# Altium schematic sheet Sheet2.SchDoc
size A3
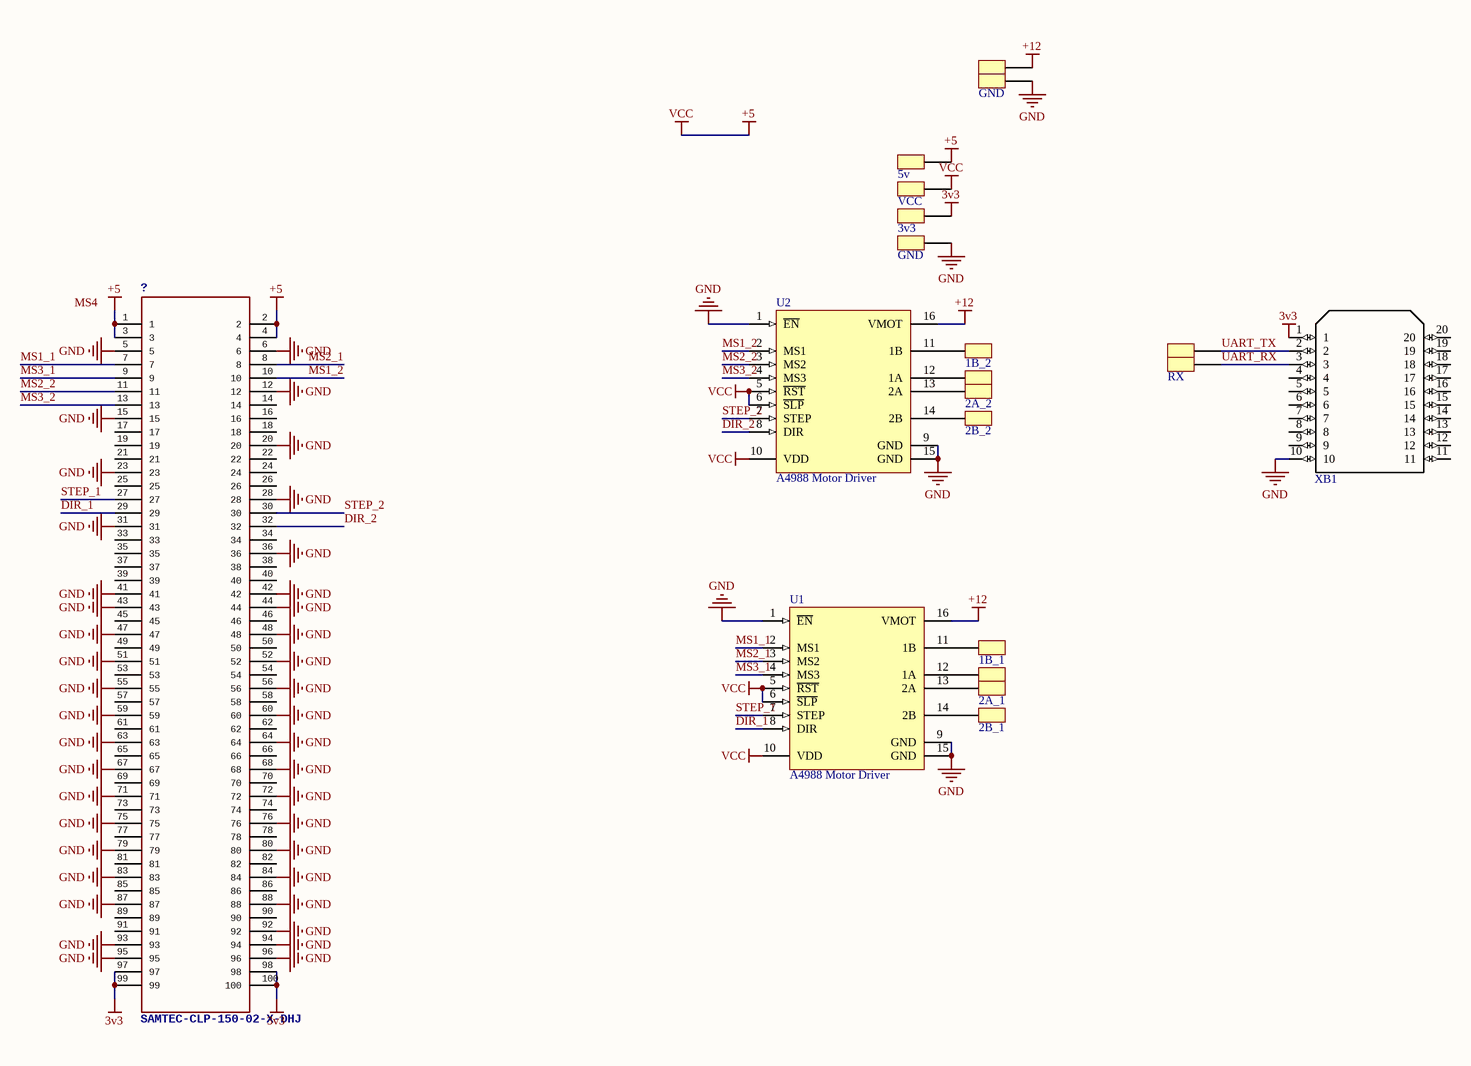
[diagram p0: Sheet2.SchDoc]

## Parts
(Parts that share a designator on the sheet are numbered #1, #2 ... from top to bottom, then left to right.)
1A_1  Pin 100mil  [Pin 100mil]  (value not drawn)
1A_2  Pin 100mil  [Pin 100mil]  (value not drawn)
1B_1  Pin 100mil  [Pin 100mil]  (value not drawn)
1B_2  Pin 100mil  [Pin 100mil]  (value not drawn)
2A_1  Pin 100mil  [Pin 100mil]  (value not drawn)
2A_2  Pin 100mil  [Pin 100mil]  (value not drawn)
2B_1  Pin 100mil  [Pin 100mil]  (value not drawn)
2B_2  Pin 100mil  [Pin 100mil]  (value not drawn)
3v3  Pin 100mil  [Pin 100mil]  (value not drawn)
5v  Pin 100mil  [Pin 100mil]  (value not drawn)
12V  Pin 100mil  [Pin 100mil]  (value not drawn)
?  SAMTEC-CLP-150-02-X-DHJ  [SAMTEC-CLP-150-02-X-DH]
GND#1  Pin 100mil  [Pin 100mil]  (value not drawn)
GND#2  Pin 100mil  [Pin 100mil]  (value not drawn)
RX  Pin 100mil  [Pin 100mil]  (value not drawn)
TX  Pin 100mil  [Pin 100mil]  (value not drawn)
U1  A4988 Motor Driver  [Polo-A4988 Motor Driver_V]
U2  A4988 Motor Driver  [Polo-A4988 Motor Driver_V]
VCC  Pin 100mil  [Pin 100mil]  (value not drawn)
XB1  XB24CDMPIT-001  [*DIP-20]  (value not drawn)

## Nets
3v3: 3v3.0 ?.97 ?.98 ?.99 ?.100 XB1.1
+5: 5v.0 ?.1 ?.2 ?.3 ?.4 U1.5(~{RST}) U1.6(~{SLP}) U1.10(VDD) U2.5(~{RST}) U2.6(~{SLP}) U2.10(VDD) VCC.0  [also labelled VCC]
+12: 12V.0 U1.16(VMOT) U2.16(VMOT)
GND: ?.5 ?.6 ?.12 ?.15 ?.20 ?.23 ?.28 ?.31 ?.36 ?.41 ?.42 ?.43 ?.44 ?.47 ?.48 ?.51 ?.52 ?.55 ?.56 ?.59 ?.60 ?.63 ?.64 ?.67 ?.68 ?.71 ?.72 ?.75 ?.76 ?.79 ?.80 ?.83 ?.84 ?.87 ?.88 ?.92 ?.93 ?.94 ?.95 ?.96 GND#1.0 GND#2.0 U1.1(~{EN}) U1.9(GND) U1.15(GND) U2.1(~{EN}) U2.9(GND) U2.15(GND) XB1.10
DIR_1: ?.29 U1.8(DIR)
DIR_2: ?.32 U2.8(DIR)
MS1_1: ?.7 U1.2(MS1)
MS1_2: ?.10 U2.2(MS1)
MS2_1: ?.8 U1.3(MS2)
MS2_2: ?.11 U2.3(MS2)
MS3_1: ?.9 U1.4(MS3)
MS3_2: ?.13 U2.4(MS3)
STEP_1: ?.27 U1.7(STEP)
STEP_2: ?.30 U2.7(STEP)
UART_RX: RX.0 XB1.3
UART_TX: TX.0 XB1.2
Net1A_1_0: 1A_1.0 U1.12(1A)
Net1A_2_0: 1A_2.0 U2.12(1A)
Net1B_1_0: 1B_1.0 U1.11(1B)
Net1B_2_0: 1B_2.0 U2.11(1B)
Net2A_1_0: 2A_1.0 U1.13(2A)
Net2A_2_0: 2A_2.0 U2.13(2A)
Net2B_1_0: 2B_1.0 U1.14(2B)
Net2B_2_0: 2B_2.0 U2.14(2B)

Not connected (* = marked no-connect by the designer): ? 14 16 17 18 19 21 22 24 25 26 33 34 35 37 38 39 40 45 46 49 50 53 54 57 58 61 62 65 66 69 70 73 74 77 78 81 82 85 86 89 90 91; XB1 4 5 6 7 8 9 11 12 13 14 15 16 17 18 19 20

## Notes on the sheet
- Labels drawn without touching a wire or pin: MS4
- Title
- Size:
- Date:
- A3
- Number:
- Time:
- Revision:
- Sheet
- of
- File:

## Library data of the parts
1A_1 1A_2 1B_1 1B_2 2A_1 2A_2 2B_1 2B_2 3v3 5v 12V GND#1 GND#2 RX TX VCC = 1-Pin
U1 U2 = CMP-1766-00001-1: Stepper Motor Driver Carrier, 3 to 5.5 V, 2 A, 16-Pin THD; Frequency: 3 MHz; Min Input Voltage: 3 V; Outputs: 1; Output Voltage: 4.5 V; Output Current: 1 A; Case\Package: SOT-23-5; Max Input Voltage: 5.5 V; Package Quantity: 250; ComponentLink1Description: Datasheet; Switching Frequency: 3 MHz; ComponentLink1URL: https://www.pololu.com/file/0J1082/a4988-stepper-motor-driver-carrier-dimension-diagram.pdf; DatasheetVersion: Dec-15; Pins: 5; Packaging: Tape and Reel; REACH SVHC: No SVHC; PackageReference: A4988 Motor Driver; Max Operating Temperature: 125 degC; PackageDescription: 16-Pin Through Hole Device, Body 20.3 x 15.2 mm, Pitch 2.54 mm; Mount: Surface Mount; RoHSCompliant: true; Max Ouput Current: 1 A; Min Operating Temperature: -40 degC
XB1 = XB24CDMPIT-001: XBee S2C DigiMesh, 2.4GHz, TH _PCB Ant_; MF: Digi International; Availability: Unavailable; Price: None; Package: Module Digi International; SnapEDA_Link: https://www.snapeda.com/parts/XB24CDMPIT-001/Digi%20International/view-part/?ref=snap; MP: XB24CDMPIT-001; Value: *